# Altium schematic sheet 1_P1.schdoc.schdoc
size 309 x 223 mm; Symbol: Sheet-Symbol_A4; Device: Sheet-Symbol_A4; Company: 嘉立创EDA; Version: V1.0; Page Size: A4; @Project Name: Idect; @Page Count: 1; @Update Date: 2024-07-17; @Create Date: 2024-07-17; @Schematic Name: Schematic1; @Page No: 1; @Page Name: P1
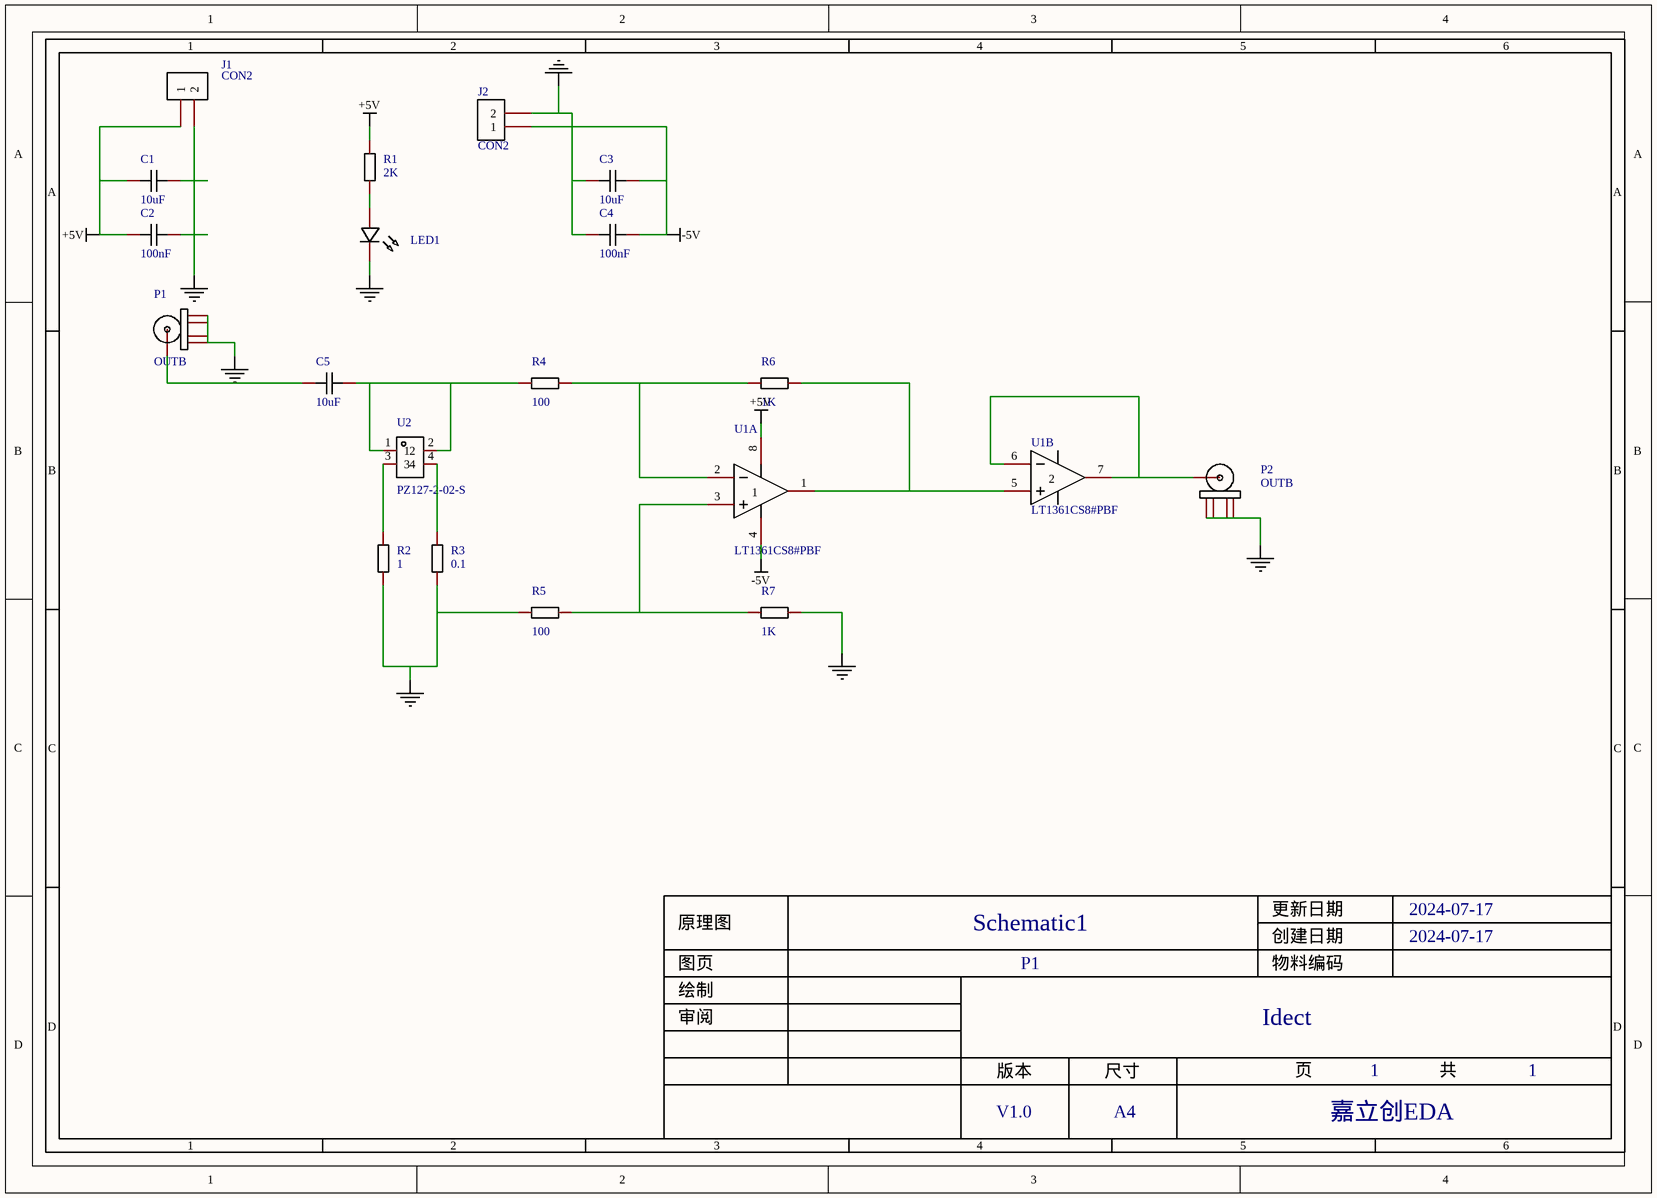
[diagram p0: 1_P1.schdoc.schdoc]

## Parts
C1  10uF  [C0805]
C2  100nF  [C0805]
C3  10uF  [C0805]
C4  100nF  [C0805]
C5  10uF  [C0805]
J1  CON2  [sip2e]
J2  CON2  [sip2e]
LED1  LED_0805-R  [LED_0805]  (value not drawn)
P1  OUTB  [SMA-E]
P2  OUTB  [SMA-E]
R1  2K  [R0805]
R2  1  [R0805]
R3  0.1  [R0805]
R4  100  [R0805]
R5  100  [R0805]
R6  1K  [R0805]
R7  1K  [R0805]
U1  LT1361CS8#PBF  [SO-8_L4.9-W3.9-P1.27-LS5.9-BL]  (parts A,B of 2)
U2  PZ127-2-02-S  [HDR-SMD_4P-P1.27-V-M-R2-C2-LS5.3]

## Nets
+5V: C1.1 C2.1 J1.1 R1.1 U1.8(V+)
-5V: C3.2 C4.2 J2.1 U1.4(V-)
GND: C1.2 C2.2 C3.1 C4.1 J1.2 J2.2 LED1.1(C) P1.2(GND) P1.3(GND) P1.4(GND) P1.5(GND) P2.2(GND) P2.3(GND) P2.4(GND) P2.5(GND) R2.1 R3.1 R5.1 R7.2
NetC5_1: C5.1 P1.1(X)
NetC5_2: C5.2 R4.1 U2.1 U2.2
NetLED1_2: LED1.2(A) R1.2
NetP2_1: P2.1(X) U1.6(INB-) U1.7(OUTB)
NetR2_2: R2.2 U2.3
NetR3_2: R3.2 U2.4
NetR4_2: R4.2 R6.1 U1.2(INA-)
NetR5_2: R5.2 R7.1 U1.3(INA+)
NetR6_2: R6.2 U1.1(OUTA) U1.5(INB+)

## Notes on the sheet
- 1
- 2
- 3
- 4
- 5
- 6
- A
- B
- C
- 原理图
- Schematic1
- 创建日期
- 更新日期
- 2024-07-17
- 审阅
- 绘制
- 图页
- P1
- 物料编码
- Idect
- D
- 版本
- 尺寸
- 页
- 共
- V1.0
- A4
- 嘉立创EDA

## Library data of the parts
C1-C5 = CAP_0805: Symbol: CapAcitance; Convert to PCB: yes; Device: CAP_0805; Add into BOM: yes; Supplier Footprint: 0805
  C1 C3 C5: Name: 10uF; Value: 10uF
  C2 C4: Name: 100nF; Value: 100nF
J1 J2 = CON2: Add into BOM: yes; Origin Footprint 2: SIP2P; Origin Footprint 3: HT3.96-2; Origin Footprint 4: SIP2; Origin Footprint 5: XH-2A; Name: CON2; Symbol: CON2; Device: CON2; Convert to PCB: yes
LED1 = LED_0805-R: Symbol: LED_R; Convert to PCB: yes; Device: LED_0805-R; Add into BOM: yes; Supplier Footprint: 0805
P1 P2 = BNC: Add into BOM: yes; Name: OUTB; Symbol: BNC; Device: BNC; Convert to PCB: yes; Origin Footprint 2: BNC
R1-R7 = Res_0805: Symbol: 电阻; Convert to PCB: yes; Device: Res_0805; Add into BOM: yes; Supplier Footprint: 0805
  R1: Name: 2K; Value: 2K
  R2: Name: 1; Value: 1
  R3: Name: 0.1; Value: 0.1
  R4 R5: Name: 100; Value: 100
  R6 R7: Name: 1K; Value: 1K
U1 = LT1361CS8#PBF: Manufacturer: ADI(亚德诺); Add into BOM: yes; Number of Circuits: 双路; Gain Bandwidth Product(GBP): 50MHz; Current - Input Bias(Ib): 300nA; Slew Rate(SR): 800V/us; Output Current: 34mA; Description: 放大器数:双路;增益带宽积(GBP):50MHz;输入偏置电流(Ib):300nA;压摆率(SR):800V/us;带宽(-3db):-;; Name: LT1361CS8#PBF; Symbol: LT1361CS8#PBF; Device: LT1361CS8#PBF; LCSC Part Name: LT1361CS8#PBF; Supplier Part: C579720; Manufacturer Part: LT1361CS8#PBF; Supplier Footprint: SO-8; JLCPCB Part Class: 扩展库; Datasheet: https://atta.szlcsc.com/upload/public/pdf/source/20200824/C579720_E3C843831E8BF30D41BDE101BF52A14A.pdf; Supplier: LCSC; Convert to PCB: yes; -3db Bandwidth: -; Operating Temperature: -40℃~+85℃
U2 = PZ127-2-02-S: Manufacturer: HCTL(华灿天禄); Add into BOM: yes; Pin Structure: 2x2P; Pitch: 1.27mm; Circluar Pins/Square Pins: 方针; Current Rating (Max): 1A; Soldering Temperature(Max): 260℃@10S; Description: 插针结构:2x2P;间距:1.27mm;行距:1.27mm;圆针/方针:方针;安装类型:立贴;排数:双排;总PIN位数:4P;额定电流:1A;配合针长度:4mm;塑高:1.5mm;端接针长度:-;触头材质:黄铜;工作温度范围:-40℃~+105℃;焊接温度(最大值):260℃@10S;颜色:黑色;; Name: PZ127-2-02-S; Symbol: PZ127-2-02-S; Device: PZ127-2-02-S; LCSC Part Name: 2x2P 间距:1.27mm 方针 立贴; Supplier Part: C3975185; Manufacturer Part: PZ127-2-02-S; Supplier Footprint: SMD,P=1.27mm; JLCPCB Part Class: 扩展库; Datasheet: https://atta.szlcsc.com/upload/public/pdf/source/20230609/2ACB07ADC7D4DAF6D292F3D23C037F6C.pdf; Supplier: LCSC; Convert to PCB: yes; Row Spacing: 1.27mm; Mounting Type: 立贴; Number of Rows: 双排; Number of Pins: 4P; Length of Mating Pin: 4mm; Insulation Height: 1.5mm; Length of End Connection Pin: -; Contact Material: 黄铜; Operating Temperature Range: -40℃~+105℃; Color: 黑色